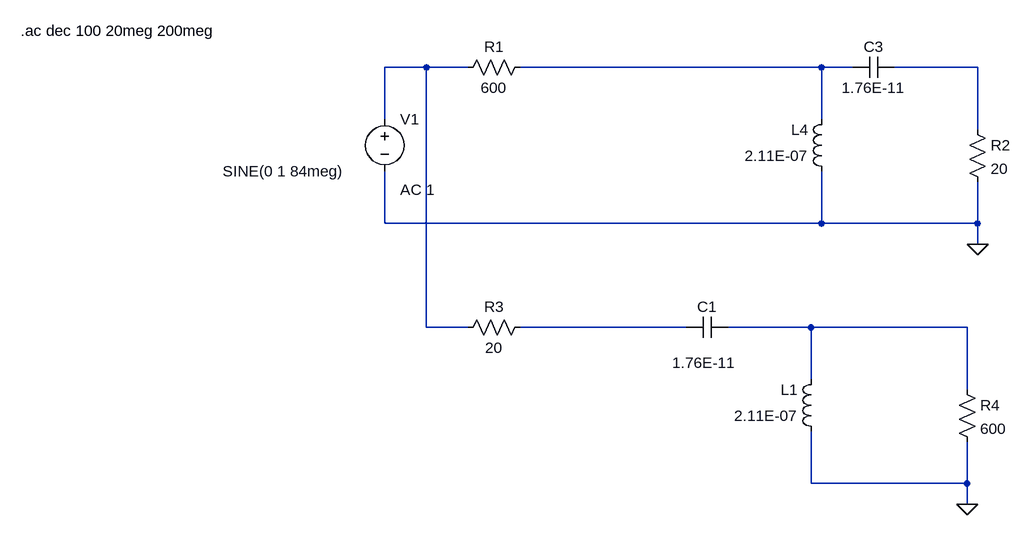
[diagram p0: schematic L match.asc]
L match.asc, the LTspice schematic file:
Version 4
SHEET 1 1476 680
WIRE -128 -480 -192 -480
WIRE -64 -480 -128 -480
WIRE 480 -480 16 -480
WIRE 528 -480 480 -480
WIRE 720 -480 592 -480
WIRE -192 -400 -192 -480
WIRE 480 -400 480 -480
WIRE 720 -384 720 -480
WIRE -192 -240 -192 -320
WIRE 480 -240 480 -320
WIRE 480 -240 -192 -240
WIRE 720 -240 720 -304
WIRE 720 -240 480 -240
WIRE 720 -208 720 -240
WIRE -128 -80 -128 -480
WIRE -64 -80 -128 -80
WIRE 272 -80 16 -80
WIRE 464 -80 336 -80
WIRE 704 -80 464 -80
WIRE 464 0 464 -80
WIRE 704 16 704 -80
WIRE 464 160 464 80
WIRE 704 160 704 96
WIRE 704 160 464 160
WIRE 704 192 704 160
FLAG 720 -208 0
FLAG 704 192 0
SYMBOL res 32 -496 R90
WINDOW 0 0 56 VBottom 2
WINDOW 3 32 56 VTop 2
SYMATTR InstName R1
SYMATTR Value 600
SYMBOL voltage -192 -416 R0
WINDOW 3 -249 96 Left 2
WINDOW 123 24 124 Left 2
WINDOW 39 0 0 Left 2
SYMATTR Value SINE(0 1 84meg)
SYMATTR Value2 AC 1
SYMATTR InstName V1
SYMBOL res 704 -400 R0
SYMATTR InstName R2
SYMATTR Value 20
SYMBOL cap 528 -496 M90
WINDOW 0 0 32 VBottom 2
WINDOW 3 32 32 VTop 2
SYMATTR InstName C3
SYMATTR Value 1.76E-11
SYMBOL ind 496 -304 R180
WINDOW 0 36 80 Left 2
WINDOW 3 36 40 Left 2
SYMATTR InstName L4
SYMATTR Value 2.11E-07
SYMBOL res 32 -96 R90
WINDOW 0 0 56 VBottom 2
WINDOW 3 32 56 VTop 2
SYMATTR InstName R3
SYMATTR Value 20
SYMBOL res 688 0 R0
SYMATTR InstName R4
SYMATTR Value 600
SYMBOL cap 272 -96 M90
WINDOW 0 0 32 VBottom 2
WINDOW 3 55 27 VTop 2
SYMATTR InstName C1
SYMATTR Value 1.76E-11
SYMBOL ind 480 96 R180
WINDOW 0 36 80 Left 2
WINDOW 3 36 40 Left 2
SYMATTR InstName L1
SYMATTR Value 2.11E-07
TEXT -752 -536 Left 2 !.ac dec 100 20meg 200meg

The netlist it stands for:
* L match.asc
R1 N002 N001 600
V1 N001 0 SINE(0 1 84meg) AC 1
R2 N003 0 20
C3 N002 N003 1.76E-11
L4 0 N002 2.11E-07
R3 N004 N001 20
R4 N005 0 600
C1 N004 N005 1.76E-11
L1 0 N005 2.11E-07
.ac dec 100 20meg 200meg
.backanno
.end